# Altium schematic sheet Main.SchDoc
size A4; Organization: Altium Limited; Address1: 3 Minna Close; Address2: Belrose; Address3: NSW 2085; Address4: Australia
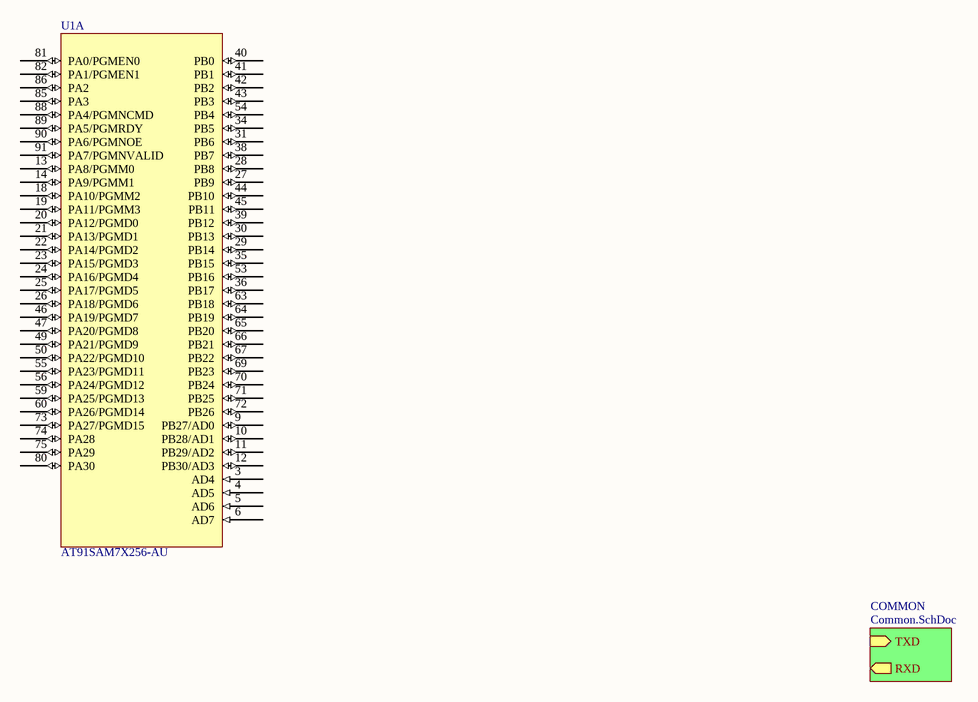
[diagram p0: Main.SchDoc]

## Parts
U1  AT91SAM7X256-AU  [LQFP100_N]  (part A of 4)

## Sub-sheets
COMMON = Common.SchDoc: TXD (in), RXD (out)

## Nets

Not connected (* = marked no-connect by the designer): U1 3(AD4) 4(AD5) 5(AD6) 6(AD7) 9(PB27/AD0) 10(PB28/AD1) 11(PB29/AD2) 12(PB30/AD3) 13(PA8/PGMM0) 14(PA9/PGMM1) 18(PA10/PGMM2) 19(PA11/PGMM3) 20(PA12/PGMD0) 21(PA13/PGMD1) 22(PA14/PGMD2) 23(PA15/PGMD3) 24(PA16/PGMD4) 25(PA17/PGMD5) 26(PA18/PGMD6) 27(PB9) 28(PB8) 29(PB14) 30(PB13) 31(PB6) 34(PB5) 35(PB15) 36(PB17) 38(PB7) 39(PB12) 40(PB0) 41(PB1) 42(PB2) 43(PB3) 44(PB10) 45(PB11) 46(PA19/PGMD7) 47(PA20/PGMD8) 49(PA21/PGMD9) 50(PA22/PGMD10) 53(PB16) 54(PB4) 55(PA23/PGMD11) 56(PA24/PGMD12) 59(PA25/PGMD13) 60(PA26/PGMD14) 63(PB18) 64(PB19) 65(PB20) 66(PB21) 67(PB22) 69(PB23) 70(PB24) 71(PB25) 72(PB26) 73(PA27/PGMD15) 74(PA28) 75(PA29) 80(PA30) 81(PA0/PGMEN0) 82(PA1/PGMEN1) 85(PA3) 86(PA2) 88(PA4/PGMNCMD) 89(PA5/PGMRDY) 90(PA6/PGMNOE) 91(PA7/PGMNVALID)

## Notes on the sheet
- Title
- Size:
- Date:
- A4
- Number:
- Time:
- Revision:
- Sheet
- of
- File:

## Library data of the parts
U1 = AT91SAM7X256-AU: Smart ARM Microcontroller, ARM7TDMI 32-Bit RISC CPU, 256KB Flash and 64KB SRAM, 100-Pin LQFP, Industrial, Pb-Free; Published: 16-Oct-2006; DatasheetVersion: 17-Oct-2005; PackageVersion: Apr-2006; PackageReference: LQFP100; Publisher: Altium Limited; PackageDescription: 100-Pin Thin Quad Flat Pack 0.5 mm Pitch; Code_JEDEC: MS-026-BED; ComponentLink1Description: Manufacturer Link; ComponentLink1URL: http://www.atmel.com; ComponentLink2Description: Datasheet; ComponentLink2URL: http://www.atmel.com/dyn/resources/prod_documents/6120s.pdf